# Altium schematic sheet gige_phy.SchDoc: GIGe Copper PHY
size B; Engineer: Michael J. Kelly; Organization: CSB540otn - Outernet; Address1: AM335x Compute Board; Address2: (C) 2015; Address3: All Rights Reserved; Address4: www.cogcomp.com; DocumentNumber: 5; Revision: P1; SheetNumber: 5; SheetTotal: 9
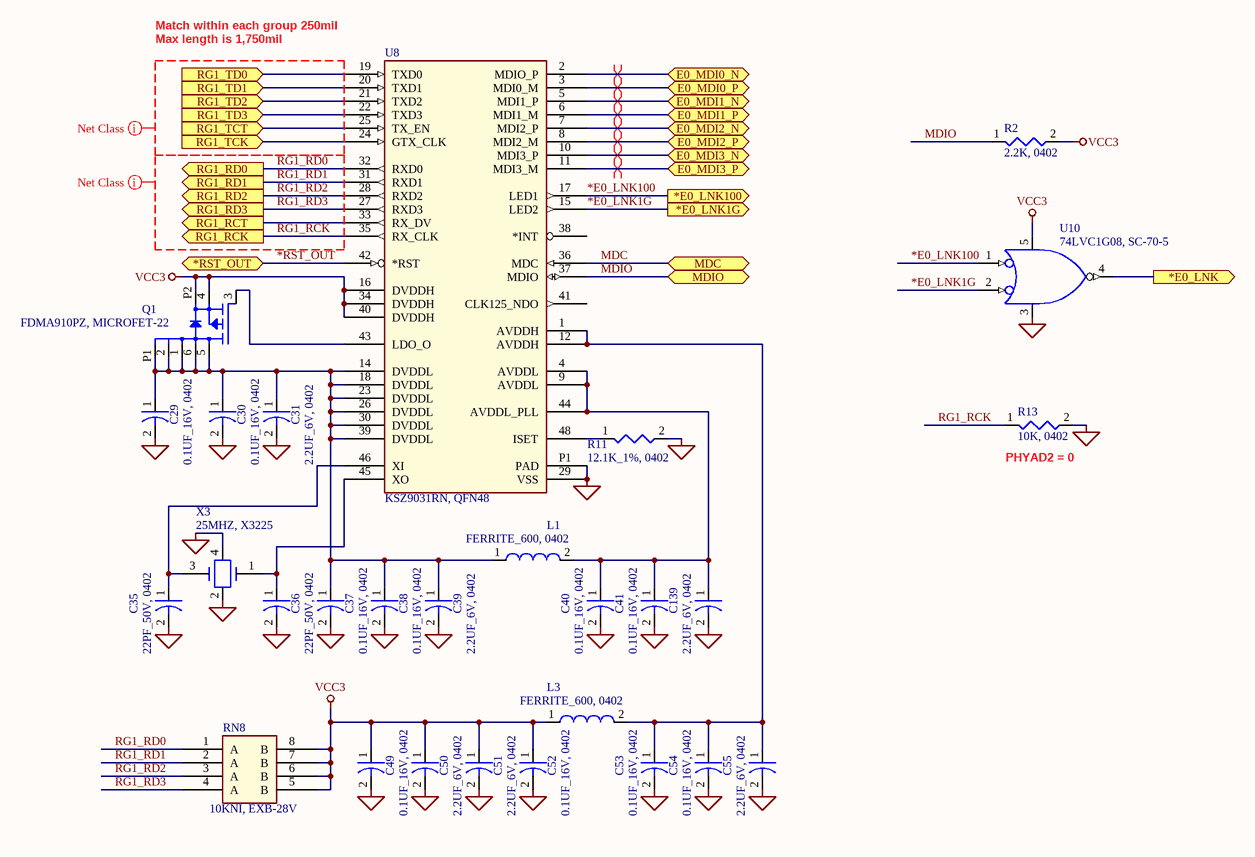
[diagram p0: gige_phy.SchDoc]

## Parts
C29  0.1UF_16V, 0402  [0402C]
C30  0.1UF_16V, 0402  [0402C]
C31  2.2UF_6V, 0402  [0402C]
C35  22PF_50V, 0402  [0402C]
C36  22PF_50V, 0402  [0402C]
C37  0.1UF_16V, 0402  [0402C]
C38  0.1UF_16V, 0402  [0402C]
C39  2.2UF_6V, 0402  [0402C]
C40  0.1UF_16V, 0402  [0402C]
C41  0.1UF_16V, 0402  [0402C]
C49  0.1UF_16V, 0402  [0402C]
C50  2.2UF_6V, 0402  [0402C]
C51  2.2UF_6V, 0402  [0402C]
C52  0.1UF_16V, 0402  [0402C]
C53  0.1UF_16V, 0402  [0402C]
C54  0.1UF_16V, 0402  [0402C]
C55  2.2UF_6V, 0402  [0402C]
C139  2.2UF_6V, 0402  [0402C]
L1  FERRITE_600, 0402  [0402L]
L3  FERRITE_600, 0402  [0402L]
Q1  FDMA910PZ, MICROFET-22  [MICROFET-22]
R2  2.2K, 0402  [0402R]
R11  12.1K_1%, 0402  [0402R]
R13  10K, 0402  [0402R]
RN8  10KNI, EXB-28V  [EXB-28V]
U8  KSZ9031RN, QFN48  [QFN48]
U10  74LVC1G08, SC-70-5  [SOT-353/SC-70-5]
X3  25MHZ, X3225  [X3225]

## Ports
*E0_LNK1G (out), *E0_LNK100 (out), *E0_LNK (out), *RST_OUT (bidir), E0_MDI0_N (bidir), E0_MDI0_P (bidir), E0_MDI1_N (bidir), E0_MDI1_P (bidir), E0_MDI2_N (bidir), E0_MDI2_P (bidir), E0_MDI3_N (bidir), E0_MDI3_P (bidir), MDC (bidir), MDIO (bidir), RG1_RCK (out), RG1_RCT (out), RG1_RD0 (out), RG1_RD1 (out), RG1_RD2 (out), RG1_RD3 (out), RG1_TCK (in), RG1_TCT (in), RG1_TD0 (in), RG1_TD1 (in), RG1_TD2 (in), RG1_TD3 (in)

## Nets
GND: C29.2 C30.2 C31.2 C35.2 C36.2 C37.2 C38.2 C39.2 C40.2 C41.2 C49.2 C50.2 C51.2 C52.2 C53.2 C54.2 C55.2 C139.2 R11.2 R13.2 U8.29(VSS) U8.P1(PAD) U10.3(GND) X3.2 X3.4
VCC3: C49.1 C50.1 C51.1 C52.1 L3.1 Q1.4 Q1.P2 R2.2 RN8.5(B) RN8.6(B) RN8.7(B) RN8.8(B) U8.16(DVDDH) U8.34(DVDDH) U8.40(DVDDH) U10.5(VCC3)
*E0_LNK: U10.4(Y) ; port *E0_LNK
*E0_LNK1G: U8.15(LED2) U10.2(B) ; port *E0_LNK1G
*E0_LNK100: U8.17(LED1) U10.1(A) ; port *E0_LNK100
*RST_OUT: U8.42(*RST) ; port *RST_OUT
E0_MDI0_N: U8.2(MDIO_P) ; port E0_MDI0_N
E0_MDI0_P: U8.3(MDI0_M) ; port E0_MDI0_P
E0_MDI1_N: U8.5(MDI1_P) ; port E0_MDI1_N
E0_MDI1_P: U8.6(MDI1_M) ; port E0_MDI1_P
E0_MDI2_N: U8.7(MDI2_P) ; port E0_MDI2_N
E0_MDI2_P: U8.8(MDI2_M) ; port E0_MDI2_P
E0_MDI3_N: U8.10(MDI3_P) ; port E0_MDI3_N
E0_MDI3_P: U8.11(MDI3_M) ; port E0_MDI3_P
MDC: U8.36(MDC) ; port MDC
MDIO: R2.1 U8.37(MDIO) ; port MDIO
RG1_RCK: R13.1 U8.35(RX_CLK) ; port RG1_RCK
RG1_RCT: U8.33(RX_DV) ; port RG1_RCT
RG1_RD0: RN8.1(A) U8.32(RXD0) ; port RG1_RD0
RG1_RD1: RN8.2(A) U8.31(RXD1) ; port RG1_RD1
RG1_RD2: RN8.3(A) U8.28(RXD2) ; port RG1_RD2
RG1_RD3: RN8.4(A) U8.27(RXD3) ; port RG1_RD3
RG1_TCK: U8.24(GTX_CLK) ; port RG1_TCK
RG1_TCT: U8.25(TX_EN) ; port RG1_TCT
RG1_TD0: U8.19(TXD0) ; port RG1_TD0
RG1_TD1: U8.20(TXD1) ; port RG1_TD1
RG1_TD2: U8.21(TXD2) ; port RG1_TD2
RG1_TD3: U8.22(TXD3) ; port RG1_TD3
NetC29_1: C29.1 C30.1 C31.1 C37.1 C38.1 C39.1 L1.1 Q1.1 Q1.2 Q1.5(D1) Q1.6(D2) Q1.P1(D5) U8.14(DVDDL) U8.18(DVDDL) U8.23(DVDDL) U8.26(DVDDL) U8.30(DVDDL) U8.39(DVDDL)
NetC35_1: C35.1 U8.46(XI) X3.3
NetC36_1: C36.1 U8.45(XO) X3.1
NetC40_1: C40.1 C41.1 C139.1 L1.2 U8.4(AVDDL) U8.9(AVDDL) U8.44(AVDDL_PLL)
NetC53_1: C53.1 C54.1 C55.1 L3.2 U8.1(AVDDH) U8.12(AVDDH)
NetQ1_3: Q1.3 U8.43(LDO_O)
NetR11_1: R11.1 U8.48(ISET)

Not connected (* = marked no-connect by the designer): U8 38(*INT) 41(CLK125_NDO)

## Layout directives
differential pair: E0_MDI0_N, E0_MDI0_P, E0_MDI1_N, E0_MDI1_P, E0_MDI2_N, E0_MDI2_P, E0_MDI3_N, E0_MDI3_P
net class E0_TX: (no net found under the mark)
net class E0_RX: RG1_RCK, RG1_RD0, RG1_RD1, RG1_RD2, RG1_RD3

## Notes on the sheet
- Match within each group 250mil
- Max length is 1,750mil
- (near R13) PHYAD2 = 0
- Title:
- Size:
- Date:
- B
- Engineer:
- Time:
- Rev:
- Sheet
- of
- File:

## Library data of the parts
C29 C30 C37 C38 C40 C41 C49 C52-C54 = 0.1UF_16V, 0402: CAP - 0402 PKG
C31 C39 C50 C51 C55 C139 = 2.2UF_6V, 0402: CAP - 0402 PKG
C35 C36 = 22PF_50V, 0402: CAP - 0402 PKG
L1 L3 = FERRITE_600, 0402: FERRITE BEAD - 600 OHM, 300MA, 0402 PKG
Q1 = FDMA910PZ, MICROFET-22: P-FET - 20V, 7.2A @ 1.8Vgs, 34mohm
R2 = 2.2K, 0402: RES - 0402 PKG
R11 = 12.1K_1%, 0402: RES - 0402 PKG
R13 = 10K, 0402: RES - 0402 PKG
RN8 = 10KNI, EXB-28V: RES NET, 4 INDIVIDUAL, EXB-28V
U8 = KSZ9031RN, QFN48: PHY - RGMII TO COPPER, 1.8V/3.3V I/O
U10 = 74LVC1G08, SC-70-5: GATE - 2-INPUT AND
X3 = 25MHZ, X3225: CRYSTAL - SMT, 3.2MM x 2.5MM, ABM8 PKG